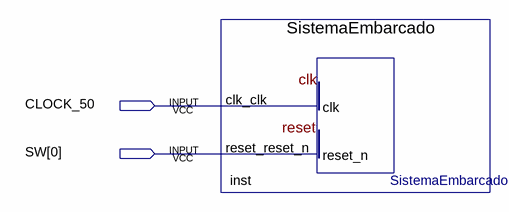
[diagram p0: schematic sheet]
// Quartus schematic ModuloProcessador.bdf as structural Verilog: 1 symbols, 2 pins
module ModuloProcessador (
  input  CLOCK_50,
  input  [0:0] SW
);

  SistemaEmbarcado inst (.clk_clk(CLOCK_50), .reset_reset_n(SW[0]));
endmodule
